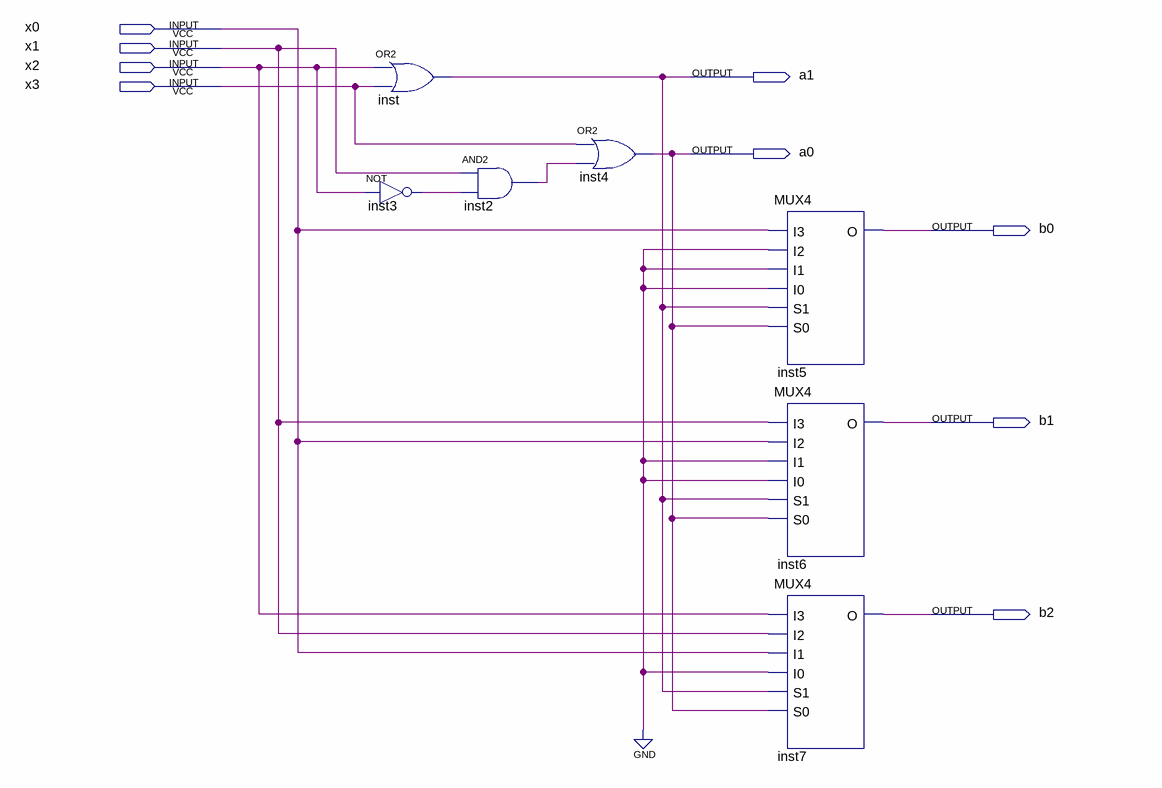
[diagram p0: schematic sheet]
// Quartus schematic Normal.bdf as structural Verilog: 7 symbols, 9 pins
module Normal (
  input  x0,
  input  x1,
  input  x2,
  input  x3,
  output a1,
  output a0,
  output b0,
  output b1,
  output b2
);

  wire inst2_out, inst3_out;

  or inst (a1, x2, x3);
  not inst3 (inst3_out, x2);
  and inst2 (inst2_out, x1, inst3_out);
  or inst4 (a0, x3, inst2_out);
  MUX4 inst5 (.I3(x0), .I2(1'b0), .I1(1'b0), .I0(1'b0), .S1(a1), .S0(a0), .O(b0));
  MUX4 inst6 (.I3(x1), .I2(x0), .I1(1'b0), .I0(1'b0), .S1(a1), .S0(a0), .O(b1));
  MUX4 inst7 (.I3(x2), .I2(x1), .I1(x0), .I0(1'b0), .S1(a1), .S0(a0), .O(b2));
endmodule
